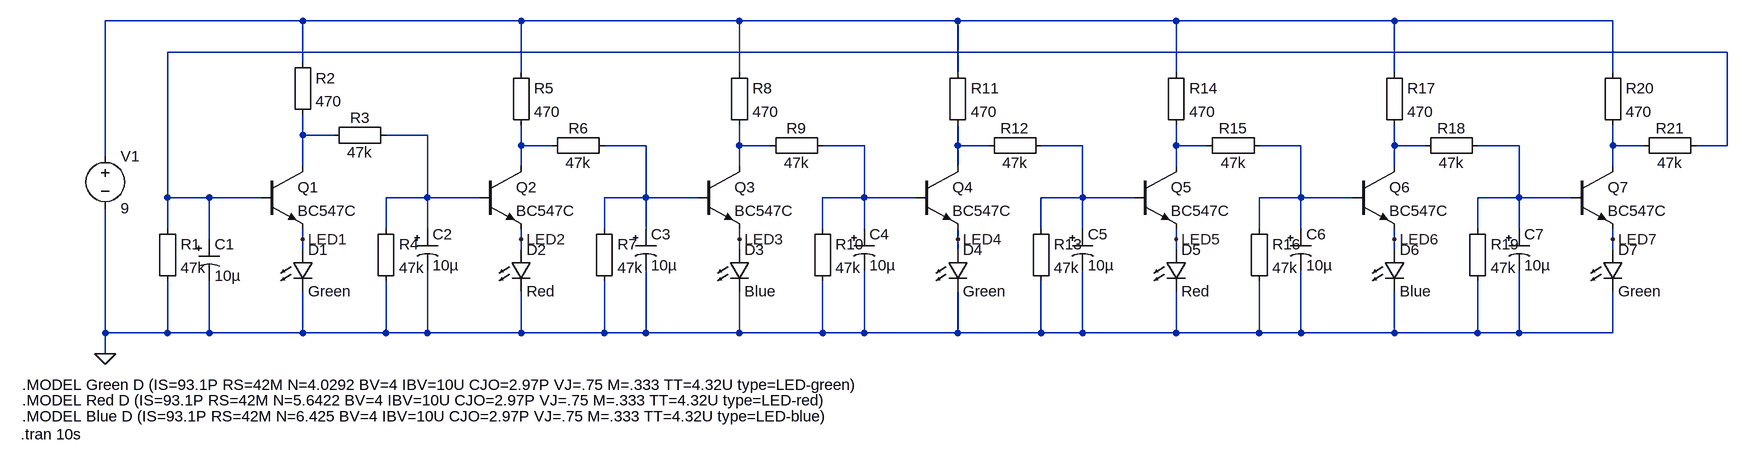
[diagram p0: schematic 7PB.asc]
7PB.asc, the LTspice schematic file:
Version 4
SHEET 1 2420 680
WIRE 224 -144 -80 -144
WIRE 560 -144 224 -144
WIRE 896 -144 560 -144
WIRE 1232 -144 896 -144
WIRE 1568 -144 1232 -144
WIRE 1904 -144 1568 -144
WIRE 2240 -144 1904 -144
WIRE 2416 -96 16 -96
WIRE 224 -80 224 -144
WIRE 560 -64 560 -144
WIRE 896 -64 896 -144
WIRE 1232 -64 1232 -144
WIRE 1568 -64 1568 -144
WIRE 1904 -64 1904 -144
WIRE 2240 -64 2240 -144
WIRE 224 32 224 0
WIRE 272 32 224 32
WIRE 416 32 352 32
WIRE 560 48 560 16
WIRE 608 48 560 48
WIRE 752 48 688 48
WIRE 896 48 896 16
WIRE 944 48 896 48
WIRE 1088 48 1024 48
WIRE 1232 48 1232 16
WIRE 1280 48 1232 48
WIRE 1424 48 1360 48
WIRE 1568 48 1568 16
WIRE 1616 48 1568 48
WIRE 1760 48 1696 48
WIRE 1904 48 1904 16
WIRE 1952 48 1904 48
WIRE 2096 48 2032 48
WIRE 2240 48 2240 16
WIRE 2288 48 2240 48
WIRE 2416 48 2416 -96
WIRE 2416 48 2368 48
WIRE -80 64 -80 -144
WIRE 224 80 224 32
WIRE 560 80 560 48
WIRE 896 80 896 48
WIRE 1232 80 1232 48
WIRE 1568 80 1568 48
WIRE 1904 80 1904 48
WIRE 2240 80 2240 48
WIRE 16 128 16 -96
WIRE 80 128 16 128
WIRE 160 128 80 128
WIRE 416 128 416 32
WIRE 416 128 352 128
WIRE 496 128 416 128
WIRE 752 128 752 48
WIRE 752 128 688 128
WIRE 832 128 752 128
WIRE 1088 128 1088 48
WIRE 1088 128 1024 128
WIRE 1168 128 1088 128
WIRE 1424 128 1424 48
WIRE 1424 128 1360 128
WIRE 1504 128 1424 128
WIRE 1760 128 1760 48
WIRE 1760 128 1696 128
WIRE 1840 128 1760 128
WIRE 2096 128 2096 48
WIRE 2096 128 2032 128
WIRE 2176 128 2096 128
WIRE 16 176 16 128
WIRE 352 176 352 128
WIRE 416 176 416 128
WIRE 688 176 688 128
WIRE 752 176 752 128
WIRE 1024 176 1024 128
WIRE 1088 176 1088 128
WIRE 1360 176 1360 128
WIRE 1424 176 1424 128
WIRE 1696 176 1696 128
WIRE 1760 176 1760 128
WIRE 2032 176 2032 128
WIRE 2096 176 2096 128
WIRE 80 192 80 128
WIRE 224 192 224 176
WIRE 560 192 560 176
WIRE 896 192 896 176
WIRE 1232 192 1232 176
WIRE 1568 192 1568 176
WIRE 1904 192 1904 176
WIRE 2240 192 2240 176
WIRE 224 208 224 192
WIRE 560 208 560 192
WIRE 896 208 896 192
WIRE 1232 208 1232 192
WIRE 1568 208 1568 192
WIRE 1904 208 1904 192
WIRE 2240 208 2240 192
WIRE -80 336 -80 144
WIRE 16 336 16 256
WIRE 16 336 -80 336
WIRE 80 336 80 256
WIRE 80 336 16 336
WIRE 224 336 224 272
WIRE 224 336 80 336
WIRE 352 336 352 256
WIRE 352 336 224 336
WIRE 416 336 416 240
WIRE 416 336 352 336
WIRE 560 336 560 272
WIRE 560 336 416 336
WIRE 688 336 688 256
WIRE 688 336 560 336
WIRE 752 336 752 240
WIRE 752 336 688 336
WIRE 896 336 896 272
WIRE 896 336 752 336
WIRE 1024 336 1024 256
WIRE 1024 336 896 336
WIRE 1088 336 1088 240
WIRE 1088 336 1024 336
WIRE 1232 336 1232 272
WIRE 1232 336 1088 336
WIRE 1360 336 1360 256
WIRE 1360 336 1232 336
WIRE 1424 336 1424 240
WIRE 1424 336 1360 336
WIRE 1568 336 1568 272
WIRE 1568 336 1424 336
WIRE 1696 336 1696 256
WIRE 1696 336 1568 336
WIRE 1760 336 1760 240
WIRE 1760 336 1696 336
WIRE 1904 336 1904 272
WIRE 1904 336 1760 336
WIRE 2032 336 2032 256
WIRE 2032 336 1904 336
WIRE 2096 336 2096 240
WIRE 2096 336 2032 336
WIRE 2240 336 2240 272
WIRE 2240 336 2096 336
WIRE -80 368 -80 336
FLAG -80 368 0
FLAG 224 192 LED1
FLAG 560 192 LED2
FLAG 896 192 LED3
FLAG 1232 192 LED4
FLAG 1568 192 LED5
FLAG 1904 192 LED6
FLAG 2240 192 LED7
SYMBOL EuropeanResistor 0 160 R0
SYMATTR InstName R1
SYMATTR Value 47k
SYMBOL EuropeanPolcap 64 192 R0
SYMATTR InstName C1
SYMATTR Value 10µ
SYMBOL npn 160 80 R0
SYMATTR InstName Q1
SYMATTR Value BC547C
SYMBOL EuropeanResistor 208 -96 R0
SYMATTR InstName R2
SYMATTR Value 470
SYMBOL EuropeanResistor 368 16 R90
WINDOW 0 5 56 VBottom 2
WINDOW 3 27 56 VTop 2
SYMATTR InstName R3
SYMATTR Value 47k
SYMBOL EuropeanResistor 336 160 R0
SYMATTR InstName R4
SYMATTR Value 47k
SYMBOL EuropeanPolcap 400 176 R0
SYMATTR InstName C2
SYMATTR Value 10µ
SYMBOL npn 496 80 R0
SYMATTR InstName Q2
SYMATTR Value BC547C
SYMBOL EuropeanResistor 544 -80 R0
SYMATTR InstName R5
SYMATTR Value 470
SYMBOL EuropeanResistor 704 32 R90
WINDOW 0 5 56 VBottom 2
WINDOW 3 27 56 VTop 2
SYMATTR InstName R6
SYMATTR Value 47k
SYMBOL EuropeanResistor 672 160 R0
SYMATTR InstName R7
SYMATTR Value 47k
SYMBOL EuropeanPolcap 736 176 R0
SYMATTR InstName C3
SYMATTR Value 10µ
SYMBOL npn 832 80 R0
SYMATTR InstName Q3
SYMATTR Value BC547C
SYMBOL EuropeanResistor 880 -80 R0
SYMATTR InstName R8
SYMATTR Value 470
SYMBOL EuropeanResistor 1040 32 R90
WINDOW 0 5 56 VBottom 2
WINDOW 3 27 56 VTop 2
SYMATTR InstName R9
SYMATTR Value 47k
SYMBOL EuropeanResistor 1008 160 R0
SYMATTR InstName R10
SYMATTR Value 47k
SYMBOL EuropeanPolcap 1072 176 R0
SYMATTR InstName C4
SYMATTR Value 10µ
SYMBOL npn 1168 80 R0
SYMATTR InstName Q4
SYMATTR Value BC547C
SYMBOL EuropeanResistor 1216 -80 R0
SYMATTR InstName R11
SYMATTR Value 470
SYMBOL EuropeanResistor 1376 32 R90
WINDOW 0 5 56 VBottom 2
WINDOW 3 27 56 VTop 2
SYMATTR InstName R12
SYMATTR Value 47k
SYMBOL EuropeanResistor 1344 160 R0
SYMATTR InstName R13
SYMATTR Value 47k
SYMBOL EuropeanPolcap 1408 176 R0
SYMATTR InstName C5
SYMATTR Value 10µ
SYMBOL npn 1504 80 R0
SYMATTR InstName Q5
SYMATTR Value BC547C
SYMBOL EuropeanResistor 1552 -80 R0
SYMATTR InstName R14
SYMATTR Value 470
SYMBOL EuropeanResistor 1712 32 R90
WINDOW 0 5 56 VBottom 2
WINDOW 3 27 56 VTop 2
SYMATTR InstName R15
SYMATTR Value 47k
SYMBOL EuropeanResistor 1680 160 R0
SYMATTR InstName R16
SYMATTR Value 47k
SYMBOL EuropeanPolcap 1744 176 R0
SYMATTR InstName C6
SYMATTR Value 10µ
SYMBOL npn 1840 80 R0
SYMATTR InstName Q6
SYMATTR Value BC547C
SYMBOL EuropeanResistor 1888 -80 R0
SYMATTR InstName R17
SYMATTR Value 470
SYMBOL EuropeanResistor 2048 32 R90
WINDOW 0 5 56 VBottom 2
WINDOW 3 27 56 VTop 2
SYMATTR InstName R18
SYMATTR Value 47k
SYMBOL EuropeanResistor 2016 160 R0
SYMATTR InstName R19
SYMATTR Value 47k
SYMBOL EuropeanPolcap 2080 176 R0
SYMATTR InstName C7
SYMATTR Value 10µ
SYMBOL npn 2176 80 R0
SYMATTR InstName Q7
SYMATTR Value BC547C
SYMBOL EuropeanResistor 2224 -80 R0
SYMATTR InstName R20
SYMATTR Value 470
SYMBOL EuropeanResistor 2384 32 R90
WINDOW 0 5 56 VBottom 2
WINDOW 3 27 56 VTop 2
SYMATTR InstName R21
SYMATTR Value 47k
SYMBOL voltage -80 48 R0
WINDOW 123 0 0 Left 0
WINDOW 39 0 0 Left 0
SYMATTR InstName V1
SYMATTR Value 9
SYMBOL LED 208 208 R0
SYMATTR InstName D1
SYMATTR Value Green
SYMBOL LED 544 208 R0
SYMATTR InstName D2
SYMATTR Value Red
SYMBOL LED 880 208 R0
SYMATTR InstName D3
SYMATTR Value Blue
SYMBOL LED 1216 208 R0
SYMATTR InstName D4
SYMATTR Value Green
SYMBOL LED 1552 208 R0
SYMATTR InstName D5
SYMATTR Value Red
SYMBOL LED 1888 208 R0
SYMATTR InstName D6
SYMATTR Value Blue
SYMBOL LED 2224 208 R0
SYMATTR InstName D7
SYMATTR Value Green
TEXT -208 416 Left 2 !.MODEL Green D (IS=93.1P RS=42M N=4.0292 BV=4 IBV=10U CJO=2.97P VJ=.75 M=.333 TT=4.32U type=LED-green)
TEXT -208 440 Left 2 !.MODEL Red D (IS=93.1P RS=42M N=5.6422 BV=4 IBV=10U CJO=2.97P VJ=.75 M=.333 TT=4.32U type=LED-red)
TEXT -208 464 Left 2 !.MODEL Blue D (IS=93.1P RS=42M N=6.425 BV=4 IBV=10U CJO=2.97P VJ=.75 M=.333 TT=4.32U type=LED-blue)
TEXT -210 492 Left 2 !.tran 10s

The netlist it stands for:
* 7PB.asc
R1 N002 0 47k
C1 N002 0 10µ
Q1 N003 N002 LED1 0 BC547C
R2 N001 N003 470
R3 N004 N003 47k
R4 N004 0 47k
C2 N004 0 10µ
Q2 N005 N004 LED2 0 BC547C
R5 N001 N005 470
R6 N006 N005 47k
R7 N006 0 47k
C3 N006 0 10µ
Q3 N007 N006 LED3 0 BC547C
R8 N001 N007 470
R9 N008 N007 47k
R10 N008 0 47k
C4 N008 0 10µ
Q4 N009 N008 LED4 0 BC547C
R11 N001 N009 470
R12 N010 N009 47k
R13 N010 0 47k
C5 N010 0 10µ
Q5 N011 N010 LED5 0 BC547C
R14 N001 N011 470
R15 N012 N011 47k
R16 N012 0 47k
C6 N012 0 10µ
Q6 N013 N012 LED6 0 BC547C
R17 N001 N013 470
R18 N014 N013 47k
R19 N014 0 47k
C7 N014 0 10µ
Q7 N015 N014 LED7 0 BC547C
R20 N001 N015 470
R21 N002 N015 47k
V1 N001 0 9
D1 LED1 0 Green
D2 LED2 0 Red
D3 LED3 0 Blue
D4 LED4 0 Green
D5 LED5 0 Red
D6 LED6 0 Blue
D7 LED7 0 Green
.model D D
.lib standard.dio
.model NPN NPN
.model PNP PNP
.lib standard.bjt
.MODEL Green D (IS=93.1P RS=42M N=4.0292 BV=4 IBV=10U CJO=2.97P VJ=.75 M=.333 TT=4.32U type=LED-green)
.MODEL Red D (IS=93.1P RS=42M N=5.6422 BV=4 IBV=10U CJO=2.97P VJ=.75 M=.333 TT=4.32U type=LED-red)
.MODEL Blue D (IS=93.1P RS=42M N=6.425 BV=4 IBV=10U CJO=2.97P VJ=.75 M=.333 TT=4.32U type=LED-blue)
.tran 10s
.backanno
.end